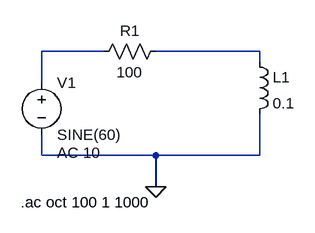
[diagram p0: schematic rl.asc]
rl.asc, the LTspice schematic file:
Version 4.1
SHEET 1 880 680
WIRE 32 112 -64 112
WIRE 272 112 112 112
WIRE 272 128 272 112
WIRE -64 160 -64 112
WIRE -64 272 -64 240
WIRE 112 272 -64 272
WIRE 272 272 272 208
WIRE 272 272 112 272
WIRE 112 320 112 272
FLAG 112 320 0
SYMBOL res 128 96 R90
WINDOW 0 0 56 VBottom 2
WINDOW 3 32 56 VTop 2
SYMATTR InstName R1
SYMATTR Value 100
SYMBOL ind 256 112 R0
SYMATTR InstName L1
SYMATTR Value 0.1
SYMBOL voltage -64 144 R0
WINDOW 123 24 124 Left 2
WINDOW 39 0 0 Left 0
SYMATTR InstName V1
SYMATTR Value SINE(60)
SYMATTR Value2 AC 10
TEXT -96 344 Left 2 !.ac oct 100 1 1000

The netlist it stands for:
* rl.asc
R1 N002 N001 100
L1 N002 0 0.1
V1 N001 0 SINE(60) AC 10
.ac oct 100 1 1000
.backanno
.end